# EAGLE design Integration board_3008_version_2 (EAGLE 9.3.0)
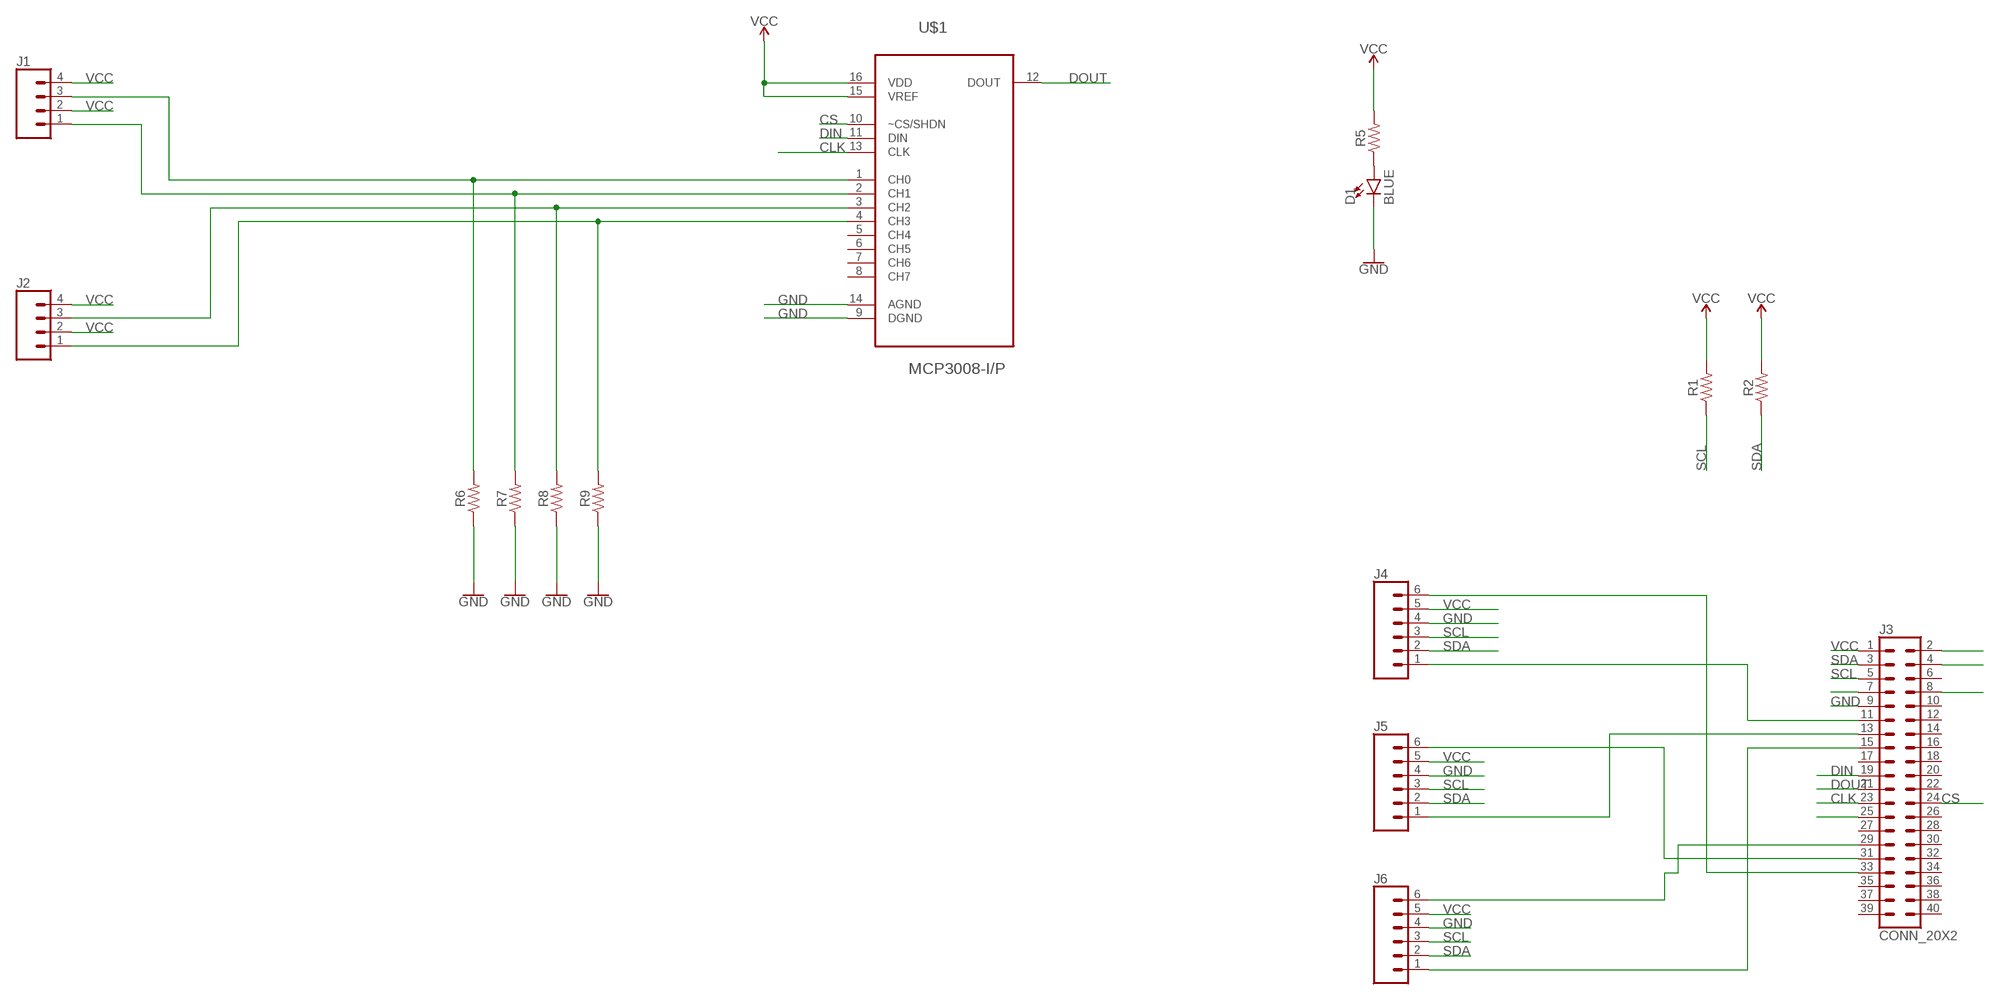
[diagram p0: schematic, sheet 1]

## Parts
D1  BLUE  LED-BLUE0603  [LED-0603]
J1  CONN_04PTH  [1X04]
J2  CONN_04PTH  [1X04]
J3  CONN_20X2  [2X20]
J4  CONN_06SILK_FEMALE_PTH  [1X06]
J5  CONN_06SILK_FEMALE_PTH  [1X06]
J6  CONN_06SILK_FEMALE_PTH  [1X06]
R1  RESISTOR0805  [0805]
R2  RESISTOR0805  [0805]
R5  RESISTOR0805  [0805]
R6  RESISTOR0805  [0805]
R7  RESISTOR0805  [0805]
R8  RESISTOR0805  [0805]
R9  RESISTOR0805  [0805]
U$1  MCP3008-I/P  [DIP254P762X432-16]

## Nets
CLK: J3.23 U$1.13(CLK)
CS: J3.24 U$1.10(~CS/SHDN)
DIN: J3.19 U$1.11(DIN)
DOUT: J3.21 U$1.12(DOUT)
GND: D1.C J3.9 J4.4 J5.4 J6.4 R6.1 R7.1 R8.1 R9.1 U$1.9(DGND) U$1.14(AGND)
N$1: J1.3 R6.2 U$1.1(CH0)
N$2: J3.11 J4.1
N$3: J2.3 R8.2 U$1.3(CH2)
N$4: J2.1 R9.2 U$1.4(CH3)
N$5: J3.13 J5.1
N$6: J3.29 J6.6
N$7: J3.31 J5.6
N$8: J3.7
N$9: J3.2
N$10: J3.4
N$11: D1.A R5.1
N$12: J3.8
N$13: J3.25
N$15: J1.1 R7.2 U$1.2(CH1)
N$17: J3.33 J4.6
N$29: J3.15 J6.1
SCL: J3.5 J4.3 J5.3 J6.3 R1.1
SDA: J3.3 J4.2 J5.2 J6.2 R2.1
VCC: J1.2 J1.4 J2.2 J2.4 J3.1 J4.5 J5.5 J6.5 R1.2 R2.2 R5.2 U$1.15(VREF) U$1.16(VDD)
Unconnected: J3.6 J3.10 J3.12 J3.14 J3.16 J3.17 J3.18 J3.20 J3.22 J3.26 J3.27 J3.28 J3.30 J3.32 J3.34 J3.35 J3.36 J3.37 J3.38 J3.39 J3.40 U$1.5(CH4) U$1.6(CH5) U$1.7(CH6) U$1.8(CH7)

## Library data of the parts
D1 = SparkFun-LED:LED-BLUE: Blue SMD LED Used in manufacturing of various products at SparkFun Packages: 0603 - SMD 0603 package [Product Link] <http://www.digikey.com/product-detail/en/SMLE12BC7TT86/511-1589-2-ND/1641808> 1206 - SMD1206 package [Product Link] <http://www.digikey.com/product-detail/en/lite-on-inc/LTST-C150TBKT/160-1643-1-ND/573584> SparkFun Products: ESP8266 Thing-Dev Board <https://www.sparkfun.com/products/13711> RedBoard <https://www.sparkfun.com/products/12757>; PROD_ID: DIO-08575
J1 J2 = SparkFun-Connectors:CONN_04: Multi connection point. Often used as Generic Header-pin footprint for 0.1 inch spaced/style header connections On any of the 0.1 inch spaced packages, you can populate with these: Break Away Headers - Straight <https://www.sparkfun.com/products/116> (PRT-00116) Break Away Male Headers - Right Angle <https://www.sparkfun.com/products/553> (PRT-00553) Female Headers <https://www.sparkfun.com/products/115> (PRT-00115) Break Away Headers - Machine Pin <https://www.sparkfun.com/products/117> (PRT-00117) Break Away Female Headers - Swiss Machine Pin <https://www.sparkfun.com/products/743> (PRT-00743) For SCREWTERMINALS and SPRING TERMINALS visit here: Screw Terimnals on SparkFun.com <https://www.sparkfun.com/search/results?term=Screw+Terminals> (5mm/3.5mm/2.54mm spacing) This device is also useful as a general connection point to wire up your design to another part of your project. Our various solder wires solder well into these plated through hole pads. Hook-Up Wire - Assortment (Stranded, 22 AWG) <https://www.sparkfun.com/products/11375> (PRT-11375) Hook-Up Wire - Assortment (Solid Core, 22 AWG) <https://www.sparkfun.com/products/11367> (PRT-11367) View the entire wire category on our website here <https://www.sparkfun.com/categories/141> Special notes: Molex polarized connector foot print use with SKU : PRT-08231 with associated crimp pins and housings. 1MM SMD Version SKU: PRT-10208; PROD_ID: CONN-09696
J3 = SparkFun-Connectors:CONN_20X2: Multi connection point. Often used as Generic Header-pin footprint for 0.1 inch spaced/style header connections On any of the 0.1 inch spaced packages, you can populate with these: Break Away Headers - Straight <https://www.sparkfun.com/products/116> (PRT-00116) Break Away Male Headers - Right Angle <https://www.sparkfun.com/products/553> (PRT-00553) Female Headers <https://www.sparkfun.com/products/115> (PRT-00115) Break Away Headers - Machine Pin <https://www.sparkfun.com/products/117> (PRT-00117) Break Away Female Headers - Swiss Machine Pin <https://www.sparkfun.com/products/743> (PRT-00743)
J4-J6 = SparkFun-Connectors:CONN_06: Multi connection point. Often used as Generic Header-pin footprint for 0.1 inch spaced/style header connections On any of the 0.1 inch spaced packages, you can populate with these: Break Away Headers - Straight <https://www.sparkfun.com/products/116> (PRT-00116) Break Away Male Headers - Right Angle <https://www.sparkfun.com/products/553> (PRT-00553) Female Headers <https://www.sparkfun.com/products/115> (PRT-00115) Break Away Headers - Machine Pin <https://www.sparkfun.com/products/117> (PRT-00117) Break Away Female Headers - Swiss Machine Pin <https://www.sparkfun.com/products/743> (PRT-00743) Arduino Stackable Header - 6 Pin <https://www.sparkfun.com/products/9280> (PRT-09280) For SCREWTERMINALS and SPRING TERMINALS visit here: Screw Terimnals on SparkFun.com <https://www.sparkfun.com/search/results?term=Screw+Terminals> (5mm/3.5mm/2.54mm spacing) This device is also useful as a general connection point to wire up your design to another part of your project. Our various solder wires solder well into these plated through hole pads. Hook-Up Wire - Assortment (Stranded, 22 AWG) <https://www.sparkfun.com/products/11375> (PRT-11375) Hook-Up Wire - Assortment (Solid Core, 22 AWG) <https://www.sparkfun.com/products/11367> (PRT-11367) View the entire wire category on our website here <https://www.sparkfun.com/categories/141>; PROD_ID: CONN-08437
R1 R2 R5-R9 = SparkFun-Resistors:RESISTOR: Generic Resistor Package
U$1 = MPU3008:MCP3008-I/P: ADC; MPN: MCP3008-I/P; OC_FARNELL: 1627174; OC_NEWARK: 19C7200; PACKAGE: DIP-16; SUPPLIER: Microchip

## Board
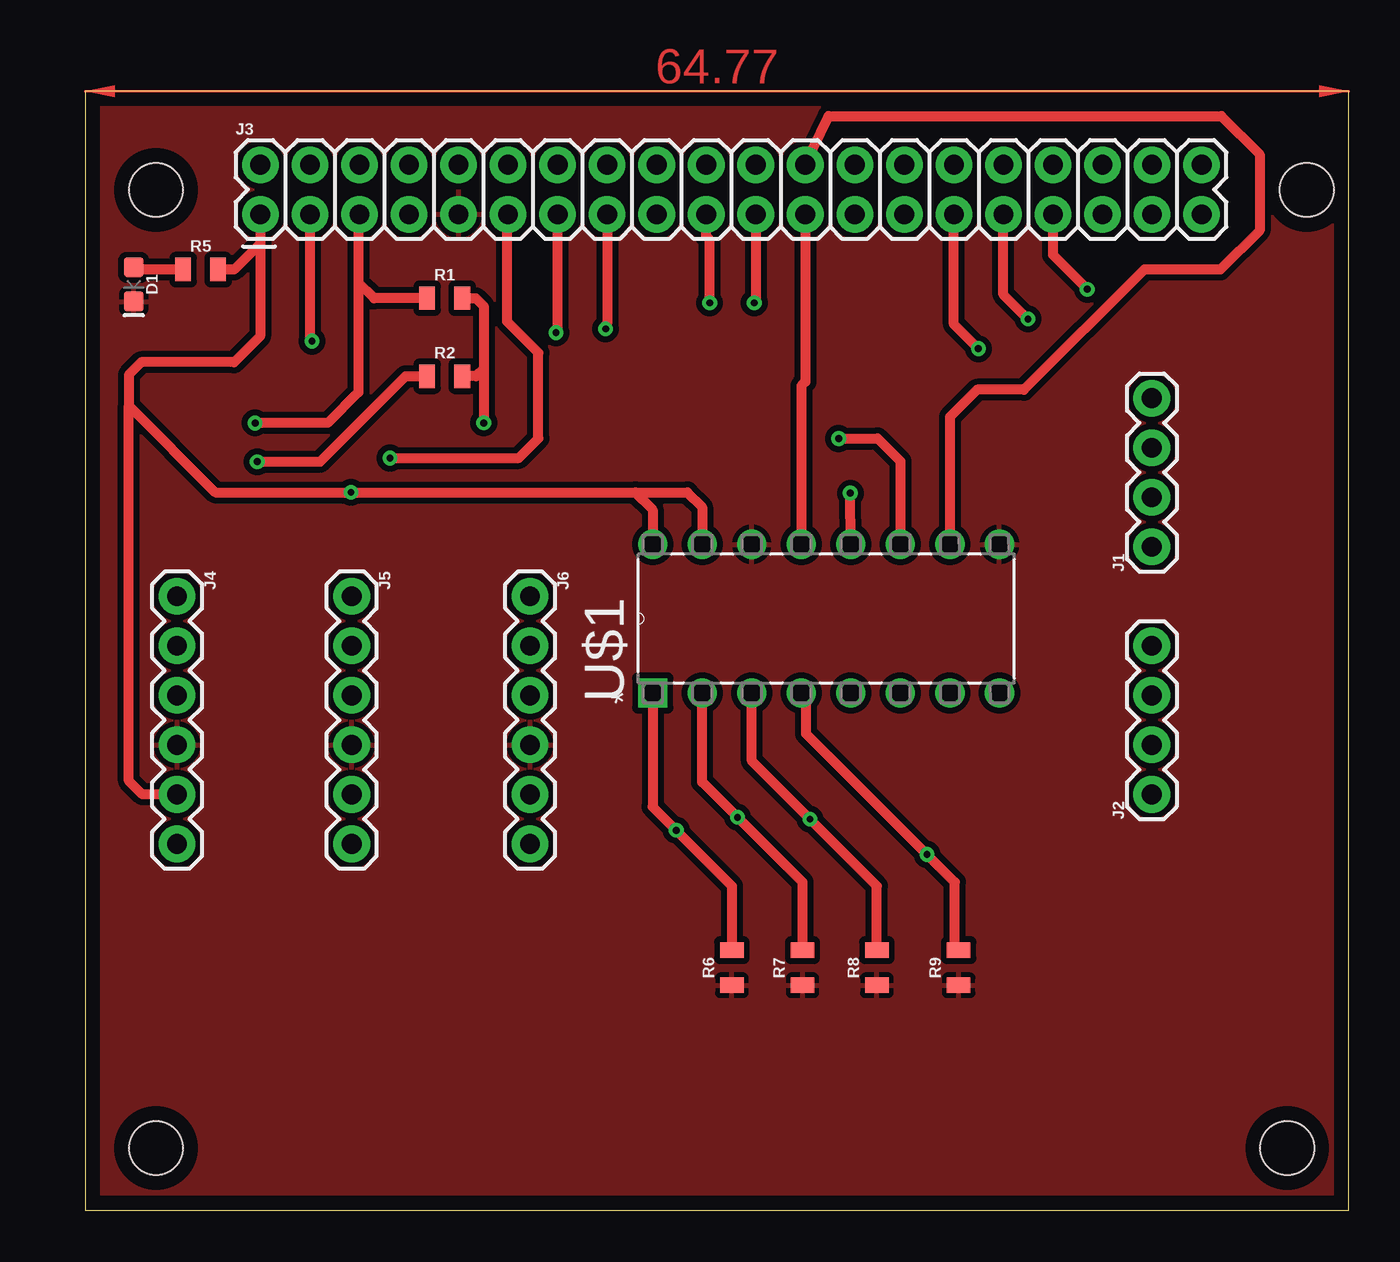
[diagram p1: board, top side]
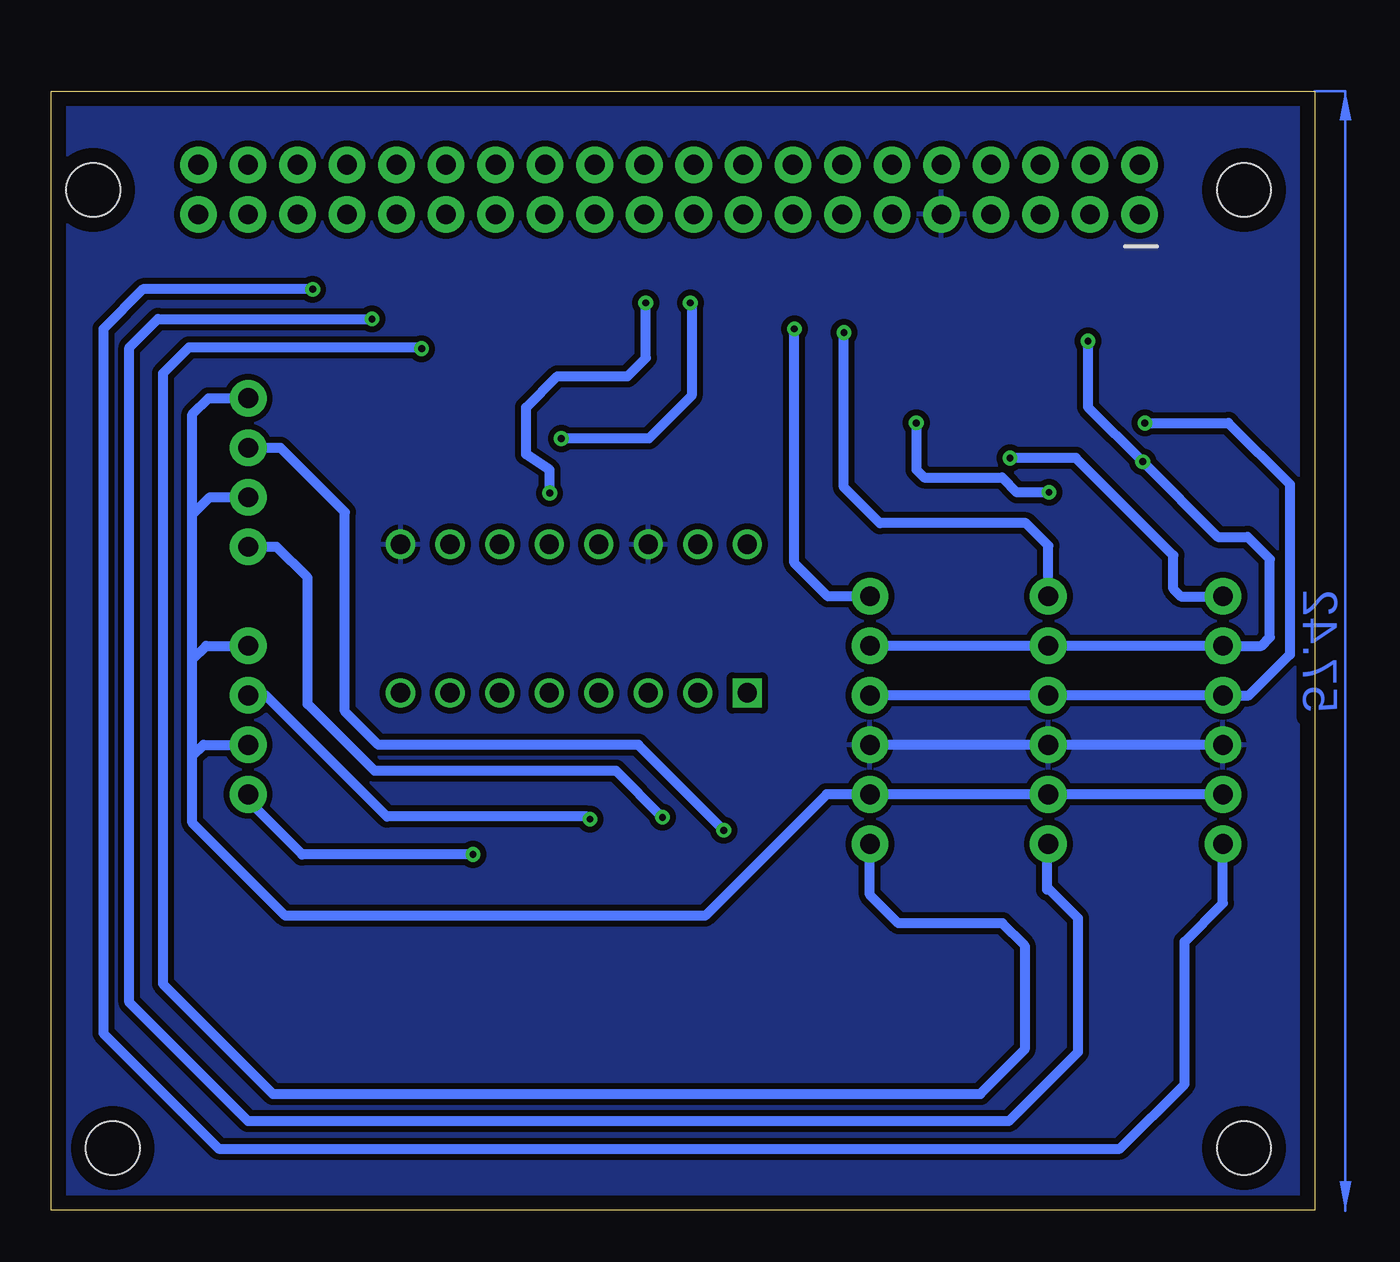
[diagram p2: board, bottom side, seen from below]

Size 64.77 x 57.41 mm. Coordinates in mm from the lower left corner, seen from the top.
Outline: 0,0 64.77,0.02 64.77,57.41 0,57.41 0,0
Copper layers (1*16): Top 0.035mm / dielectric 1.5mm / Bottom 0.035mm
Design rules "default *": minimum track width 10mil, minimum drill 0.35mm, track to track 10mil, track to pad 10mil, pad to pad 10mil, via to via 10mil, smd to smd 10mil, copper to edge 30mil, drill to drill 20mil, minimum pad ring 10mil, minimum via ring 8mil, stop-mask expansion 4mil, vias tented up to drill 0mil, thermal gap 10mil
Holes 2.75 mm at 3.62,52.34 62.62,52.34 3.62,3.19 61.62,3.19

### Footprints (pad centres in the part's own frame; a part is rotated, then mirrored left to right if it is on the bottom)
LED-0603 = smd 1 x 1: A -0.877,0; C 0.877,0
1X04 = drill 1.016 pad 1.88: 1 0,0; 2 2.54,0; 3 5.08,0; 4 7.62,0
2X20 = drill 1.016 pad 1.88: 1 0,0; 2 0,2.54; 3 2.54,0; 4 2.54,2.54; 5 5.08,0; 6 5.08,2.54; 7 7.62,0; 8 7.62,2.54; 9 10.16,0; 10 10.16,2.54; 11 12.7,0; 12 12.7,2.54; 13 15.24,0; 14 15.24,2.54; 15 17.78,0; 16 17.78,2.54; 17 20.32,0; 18 20.32,2.54; 19 22.86,0; 20 22.86,2.54; 21 25.4,0; 22 25.4,2.54; 23 27.94,0; 24 27.94,2.54; 25 30.48,0; 26 30.48,2.54; 27 33.02,0; 28 33.02,2.54; 29 35.56,0; 30 35.56,2.54; 31 38.1,0; 32 38.1,2.54; 33 40.64,0; 34 40.64,2.54; 35 43.18,0; 36 43.18,2.54; 37 45.72,0; 38 45.72,2.54; 39 48.26,0; 40 48.26,2.54
1X06 = drill 1.016 pad 1.88: 1 0,0; 2 2.54,0; 3 5.08,0; 4 7.62,0; 5 10.16,0; 6 12.7,0
0805 = smd 0.8 x 1.2: 1 -0.9,0; 2 0.9,0
DIP254P762X432-16 = drill 0.991 square: 1 -7.62,17.78 | drill 0.991: 2 -7.62,15.24; 3 -7.62,12.7; 4 -7.62,10.16; 5 -7.62,7.62; 6 -7.62,5.08; 7 -7.62,2.54; 8 -7.62,0; 9 0,0; 10 0,2.54; 11 0,5.08; 12 0,7.62; 13 0,10.16; 14 0,12.7; 15 0,15.24; 16 0,17.78

### Placement (x,y rotation side)
D1  2.48,47.5 270 top
J1  54.67,34.04 90 top
J2  54.67,21.34 90 top
J3  8.97,51.09 0 top
J4  4.7,31.5 270 top
J5  13.65,31.5 270 top
J6  22.8,31.5 270 top
R1  18.42,46.8 0 top
R2  18.42,42.8 0 top
R5  5.91,48.27 0 top
R6  33.15,12.45 90 top
R7  36.77,12.45 90 top
R8  40.58,12.45 90 top
R9  44.77,12.45 90 top
U$1  46.86,34.17 90 top

### Tracks (layer width: path | path; a pad name or v marks a point on that pad's centre or on a via)
CLK
  Top 0.508: J3.23 36.91,42.5 36.7,42.3 U$1.13
CS
  Top 0.508: J3.24 38.1,56.13 58.24,56.13 60.2,54.17 60.2,50.27 58.2,48.27 54.29,48.27 48.12,42.09 45.72,42.09 44.32,40.7 U$1.10
DIN  (via drill 0.35)
  Top 0.508: v32,46.55 32,49.79 31.83,49.97 J3.19 | v38.62,39.59 40.62,39.59 41.78,38.43 U$1.11
  Bottom 0.508: v32,46.55 31.94,46.49 31.94,41.79 34.13,39.59 v38.62,39.59
DOUT  (via drill 0.35)
  Top 0.508: J3.21 34.37,46.63 v34.29,46.55 | U$1.12 v39.22,36.8
  Bottom 0.508: v39.22,36.8 39.22,37.99 40.42,38.8 40.42,41.2 38.82,42.8 35.22,42.8 34.29,43.72 v34.29,46.55
GND
  Bottom 0.508: J4.4 J5.4 J6.4
  pour Top (isolate 0.305): 0,57.41 0,0.02 64.77,0.02 64.77,57.41
  pour Bottom (isolate 0.305): 0,57.41 0,0.02 64.77,0.02 64.77,57.41
N$1  (via drill 0.35)
  Top 0.508: U$1.1 29.08,20.71 v30.29,19.5 33.15,16.64 R6.2
  Bottom 0.508: J1.3 53.02,39.12 49.72,35.82 49.72,25.6 48.01,23.88 34.67,23.88 v30.29,19.5
N$2  (via drill 0.35)
  Top 0.508: v15.62,38.59 22.22,38.59 23.22,39.59 23.22,43.99 21.62,45.59 21.62,51.05 J3.11
  Bottom 0.508: J4.1 6.86,31.5 7.24,31.88 7.24,33.6 12.24,38.59 v15.62,38.59
N$3  (via drill 0.35)
  Top 0.508: R8.2 40.58,16.64 v37.15,20.07 34.16,23.06 U$1.3
  Bottom 0.508: J2.3 53.78,26.42 47.57,20.21 37.28,20.21 v37.15,20.07
N$4  (via drill 0.35)
  Top 0.508: U$1.4 36.64,26.49 36.96,26.17 36.96,24.45 v43.15,18.26 44.58,16.83 44.58,13.54 R9.2
  Bottom 0.508: v43.15,18.26 51.91,18.26 54.67,21.02 J2.1
N$5  (via drill 0.35)
  Top 0.508: v24.13,45.03 24.21,45.11 J3.13
  Bottom 0.508: v24.13,45.03 24.13,37.1 22.29,35.26 14.8,35.26 13.65,34.11 J5.1
N$6  (via drill 0.35)
  Top 0.508: v45.78,44.2 44.53,45.46 J3.29
  Bottom 0.508: J6.6 22.8,16.2 21.34,14.74 16,14.74 14.86,13.6 14.86,8.26 17.14,5.98 53.41,5.98 59.05,11.63 59.05,42.93 57.72,44.27 45.85,44.27 v45.78,44.2
N$7  (via drill 0.35)
  Top 0.508: v48.32,45.73 47.07,46.98 J3.31
  Bottom 0.508: J5.6 13.72,18.74 13.72,16.45 13.59,16.45 12.13,14.99 12.13,8.13 15.68,4.58 54.67,4.58 60.77,10.68 60.77,44.27 59.31,45.73 v48.32,45.73
N$11
  Top 0.508: R5.1 2.59,48.27 D1.A
N$15  (via drill 0.35)
  Top 0.508: R7.2 36.77,16.83 v33.43,20.17 31.62,21.98 U$1.2
  Bottom 0.508: J1.1 53.21,34.04 51.63,32.45 51.63,25.98 48.2,22.55 35.81,22.55 v33.43,20.17
N$17  (via drill 0.35)
  Top 0.508: v51.37,47.25 49.61,49.01 J3.33
  Bottom 0.508: J4.6 4.7,15.76 6.67,13.79 6.67,6.48 9.98,3.17 56.19,3.17 62.1,9.09 62.1,45.22 60.07,47.25 v51.37,47.25
N$29  (via drill 0.35)
  Top 0.508: J3.15 26.75,45.49 26.67,45.41 v26.67,45.22
  Bottom 0.508: J6.1 24.96,31.5 26.67,33.22 v26.67,45.22
SCL  (via drill 0.35)
  Top 0.508: J3.5 14,51.09 14,47.59 | 14,47.59 14,41.98 12.42,40.39 v8.7,40.39 | R1.1 14.8,46.8 14,47.59
  Bottom 0.508: v8.7,40.39 4.41,40.39 1.27,37.25 1.27,28.52 3.37,26.42 J4.3 J5.3 J6.3
SDA  (via drill 0.35)
  Top 0.508: J3.3 11.51,44.7 v11.62,44.59 | v8.81,38.41 12.03,38.41 16.42,42.8 R2.1
  Bottom 0.508: J6.2 J5.2 J4.2 2.73,28.96 2.29,29.41 2.29,33.41 3.43,34.55 4.95,34.55 v8.81,38.41 11.62,41.22 v11.62,44.59
VCC  (via drill 0.35)
  Top 0.508: 2.22,41.28 6.67,36.84 v13.62,36.84 28.19,36.84 | 2.22,41.28 2.22,22.04 2.92,21.34 J4.5 | 28.19,36.84 29.08,35.95 U$1.16 | 28.19,36.84 30.86,36.84 31.62,36.08 U$1.15 | 2.22,41.28 2.22,42.87 2.86,43.5 7.62,43.5 8.95,44.84 8.95,49.6 | J3.1 8.95,51.08 8.95,49.6 | 8.95,49.6 7.62,48.27 R5.2 | R1.2 20.02,46.8 20.42,46.39 20.42,43.2 | 20.42,43.2 20.02,42.8 R2.2 | 20.42,43.2 v20.42,40.39
  Bottom 0.508: J4.5 J5.5 J6.5 25.02,21.34 31.24,15.12 52.77,15.12 57.53,19.88 57.53,23.31 | 57.53,23.31 56.96,23.88 J2.2 | 57.53,23.31 57.53,28.26 | J2.4 56.83,28.96 57.53,28.26 | 57.53,28.26 57.53,35.69 | J1.2 56.64,36.58 57.53,35.69 | 57.53,35.69 57.53,40.84 56.71,41.66 J1.4 | v13.62,36.84 15.26,36.84 16.02,37.59 20.02,37.59 20.42,37.99 v20.42,40.39
(copper drawn outside any net)
  shapes: Bottom area x1, Top area x1